# Altium project App6.PrjPcb
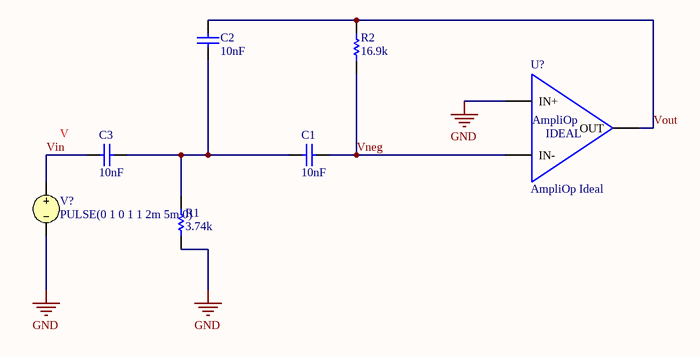
[diagram p0: Sheet1.SchDoc]
1 sheet, 7 parts. Net scope: global (net labels, ports and power ports of the same name join across sheets).

## Sheet Sheet1.SchDoc
size A4; SheetNumber: 1; SheetTotal: 1; SPICEModelCacheWPAUZKQG: <root> / <DocumentId>WPAUZKQG</DocumentId> / <CacheFrame Number="0"> / <Model Name="ideal" Kind="CKT"> / <Text>*IDEAL:Amplificateur operationnel avec gain boucle ouverte de 100K / .SUBCKT IDEAL 1 2 3 / EGAIN 3 0 1 2 1E5 / .ENDS</Text> / </Model> / </CacheFrame> / </root>

### Parts
C1  value 10nF  (hidden comment: Capacitor)
C2  value 10nF  (hidden comment: Capacitor)
C3  value 10nF  (hidden comment: Capacitor)
R1  value 3.74k  (hidden comment: Resistor)
R2  value 16.9k  (hidden comment: Resistor)
U?  AmpliOp Ideal
V?  PULSE(0 1 0 1 1 2m 5m 0)

### Nets
GND: R1.1 U?.1(IN+) V?.2
Vin: C3.1 V?.1
Vneg: C1.2 R2.1 U?.2(IN-)
Vout: C2.2 R2.2 U?.3(OUT)
NetC1_1: C1.1 C2.1 C3.2 R1.2

### Notes on the sheet
- (in symbol AmpliOp_ideal) AmpliOp; IDEAL

### Library data of the parts
C1-C3 = Capacitor: SimulationGenericComponent: True
R1 R2 = Resistor: TC1: 0; SimulationGenericComponent: True; TC2: 0
U? = AmpliOp_ideal
V? = VSRC: Voltage Source; Note: PCB Footprint - Not required; AC Magnitude: 1; AC Phase: 0; Published: 8-Jun-2000; LatestRevisionDate: 17-Jul-2002; LatestRevisionNote: Re-released for DXP Platform.; PackageReference: Not Applicable; Publisher: Altium Limited; DC Magnitude: 0; Initial Value: 0; Pulsed Value: 1; Rise Time: 1; Fall Time: 1; Pulse Width: 2m; Period: 5m; Phase: 0